# Altium schematic sheet Power VADJ.SchDoc
size Tabloid; ApprovedBy: NA
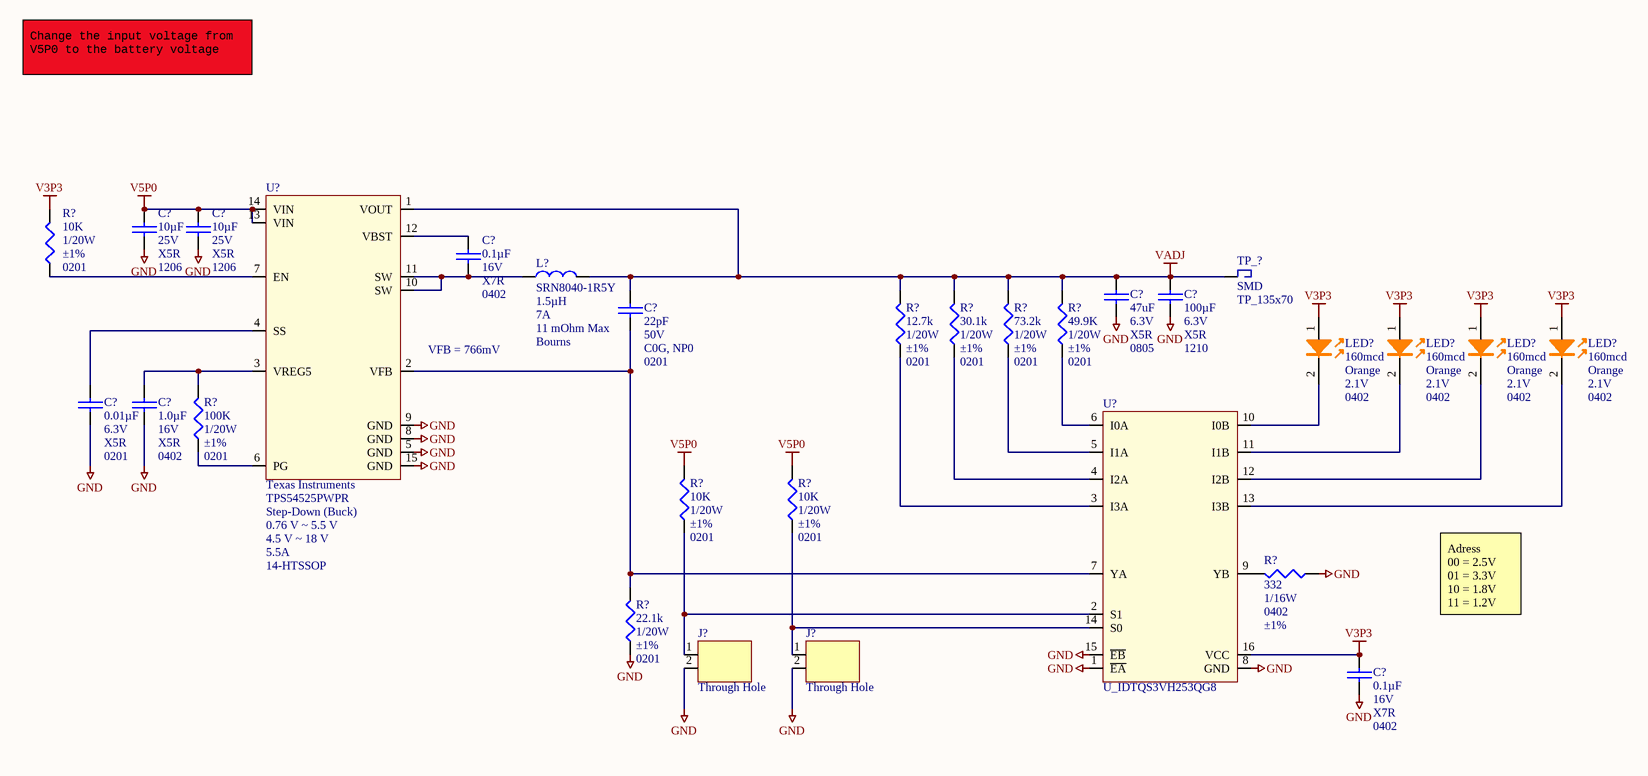
[diagram p0: Power VADJ.SchDoc]

## Parts
(Parts that share a designator on the sheet are numbered #1, #2 ... from top to bottom, then left to right.)
C?#1  Voltage - Rated: 25V  Temperature Coefficient: X5R  Package / Case: 1206  [CAP-1206]  (hidden comment: 10µF)
C?#2  Voltage - Rated: 25V  Temperature Coefficient: X5R  Package / Case: 1206  [CAP-1206]  (hidden comment: 10µF)
C?#3  Capacitance: 0.1µF  Voltage - Rated: 16V  Temperature Coefficient: X7R  Package / Case: 0402  [C_ERA-0402]  (hidden comment: 0.1uF)
C?#4  Capacitance: 22pF  Voltage - Rated: 50V  Temperature Coefficient: C0G, NP0  Package / Case: 0201  [CAPC0201]  (hidden comment: C_0201_22pF)
C?#5  Capacitance: 47uF  Voltage - Rated: 6.3V  Temperature Coefficient: X5R  Package / Case: 0805  [C_ERA-0805]  (hidden comment: C_0805_47UF_6.3V)
C?#6  Capacitance: 100µF  Voltage - Rated: 6.3V  Temperature Coefficient: X5R  Package / Case: 1210  [C_14-1210]  (hidden comment: 100uF)
C?#7  Capacitance: 0.01µF  Voltage - Rated: 6.3V  Temperature Coefficient: X5R  Package / Case: 0201  [CAPC0201]  (hidden comment: 0.01UF)
C?#8  Capacitance: 1.0µF  Voltage - Rated: 16V  Temperature Coefficient: X5R  Package / Case: 0402  [C_ERA-0402]  (hidden comment: 1.0uF)
C?#9  Capacitance: 0.1µF  Voltage - Rated: 16V  Temperature Coefficient: X7R  Package / Case: 0402  [C_ERA-0402]  (hidden comment: 0.1uF)
J?#1  Mounting Type: Through Hole  [HDR_1X2]  (hidden comment: J_HDR1X2_JUMPER)
J?#2  Mounting Type: Through Hole  [HDR_1X2]  (hidden comment: J_HDR1X2_JUMPER)
L?  Manufacturer Part Number: SRN8040-1R5Y  Inductance: 1.5µH  Current: 7A  DC Resistance (DCR): 11 mOhm Max  Manufacturer: Bourns  [INDP8080X40L]  (hidden comment: 1.5uH)
LED?#1  Millicandela Rating: 160mcd  Color: Orange  Voltage - Forward (Vf) Typ: 2.1V  Package / Case: 0402  [DIOM1005X07L_ORANGE]  (hidden comment: LED_ORN_0402)
LED?#2  Millicandela Rating: 160mcd  Color: Orange  Voltage - Forward (Vf) Typ: 2.1V  Package / Case: 0402  [DIOM1005X07L_ORANGE]  (hidden comment: LED_ORN_0402)
LED?#3  Millicandela Rating: 160mcd  Color: Orange  Voltage - Forward (Vf) Typ: 2.1V  Package / Case: 0402  [DIOM1005X07L_ORANGE]  (hidden comment: LED_ORN_0402)
LED?#4  Millicandela Rating: 160mcd  Color: Orange  Voltage - Forward (Vf) Typ: 2.1V  Package / Case: 0402  [DIOM1005X07L_ORANGE]  (hidden comment: LED_ORN_0402)
R?#1  Power (Watts): 1/20W  Tolerance: ±1%  Case: 0201  [R0201]  (hidden comment: 10K)
R?#2  Power (Watts): 1/20W  Tolerance: ±1%  Case: 0201  [R0201]  (hidden comment: 12.7k)
R?#3  Power (Watts): 1/20W  Tolerance: ±1%  Case: 0201  [R0201]  (hidden comment: 30.1k)
R?#4  Power (Watts): 1/20W  Tolerance: ±1%  Case: 0201  [R0201]  (hidden comment: 73.2k)
R?#5  Power (Watts): 1/20W  Tolerance: ±1%  Case: 0201  [R0201]  (hidden comment: 49.9K)
R?#6  Power (Watts): 1/20W  Tolerance: ±1%  Case: 0201  [R0201]  (hidden comment: 100K)
R?#7  Power (Watts): 1/20W  Tolerance: ±1%  Case: 0201  [R0201]  (hidden comment: 10K)
R?#8  Power (Watts): 1/20W  Tolerance: ±1%  Case: 0201  [R0201]  (hidden comment: 10K)
R?#9  Resistance In Ohms: 332  Power (Watts): 1/16W  Case: 0402  Tolerance: ±1%  [ERA-0402]  (hidden comment: R_0402_332.0)
R?#10  Power (Watts): 1/20W  Tolerance: ±1%  Case: 0201  [R0201]  (hidden comment: 22.1k)
TP_?  SMD  FOOTPRINT: TP_135x70  [TP_SMD]
U?#1  Manufacturer: Texas Instruments  Manufacturer Part Number: TPS54525PWPR  Type: Step-Down (Buck)  Voltage - Output: 0.76 V ~ 5.5 V  Voltage - Input: 4.5 V ~ 18 V  Current - Output: 5.5A  Supplier Device Package: 14-HTSSOP  [TSOP65P640X120_HS-15N]  (hidden comment: U_TPS54525PWPR)
U?#2  U_IDTQS3VH253QG8  [TSOP65P640X110-16N]

## Nets
GND: C?#1.1 C?#2.1 C?#5.1 C?#6.1 C?#7.1 C?#8.1 C?#9.1 J?#1.2 J?#2.2 R?#9.2 R?#10.2 U?#1.5(GND) U?#1.8(GND) U?#1.9(GND) U?#1.15(GND) U?#2.1(~{EA}) U?#2.8(GND) U?#2.15(~{EB})
V3P3: C?#9.2 LED?#1.1 LED?#2.1 LED?#3.1 LED?#4.1 R?#1.1 U?#2.16(VCC)
V5P0: C?#1.2 C?#2.2 R?#7.1 R?#8.1 U?#1.13(VIN) U?#1.14(VIN)
VADJ: C?#4.2 C?#5.2 C?#6.2 L?.2 R?#2.1 R?#3.1 R?#4.1 R?#5.1 TP_?.1 U?#1.1(VOUT)
NetC?#3_1: C?#3.1 L?.1 U?#1.10(SW) U?#1.11(SW)
NetC?#3_2: C?#3.2 U?#1.12(VBST)
NetC?#4_1: C?#4.1 R?#10.1 U?#1.2(VFB) U?#2.7(YA)
NetC?#7_2: C?#7.2 U?#1.4(SS)
NetC?#8_2: C?#8.2 R?#6.1 U?#1.3(VREG5)
NetJ?#1_1: J?#1.1 R?#7.2 U?#2.2(S1)
NetJ?#2_1: J?#2.1 R?#8.2 U?#2.14(S0)
NetLED?#1_2: LED?#1.2 U?#2.10(I0B)
NetLED?#2_2: LED?#2.2 U?#2.11(I1B)
NetLED?#3_2: LED?#3.2 U?#2.12(I2B)
NetLED?#4_2: LED?#4.2 U?#2.13(I3B)
NetR?#1_2: R?#1.2 U?#1.7(EN)
NetR?#2_2: R?#2.2 U?#2.3(I3A)
NetR?#3_2: R?#3.2 U?#2.4(I2A)
NetR?#4_2: R?#4.2 U?#2.5(I1A)
NetR?#5_2: R?#5.2 U?#2.6(I0A)
NetR?#6_2: R?#6.2 U?#1.6(PG)
NetR?#9_1: R?#9.1 U?#2.9(YB)

## Notes on the sheet
- Change the input voltage from V5P0 to the battery voltage
- (near U?#1) VFB = 766mV
- Adress
  00 = 2.5V
  01 = 3.3V
  10 = 1.8V
  11 = 1.2V
- Project:
- http://www.cospandesign.com
- Cospan Design
- Document:
- Engineer:
- Title:
- Client:
- Approved By:
- Revision:
- Date:
- Number:
- of

## Library data of the parts
C?#1 C?#2 = C_1206_10UF_25V: CAP CER 10UF 25V X5R 1206; Manufacturer: Murata Electronics North America; Manufacturer Part Number: GRM31CR61E106MA12L; Tolerance: ±20%; Supplier 1: Digi-Key; Supplier Part Number 1: 490-5423-1-ND; RoHS: RoHS Compliant; Category: Capacitors; Stock 1: 359069; Pricing: 1=0.51, 10=0.402, 50=0.2646, 100=0.2099, 250=0.15512, 500=0.12046, 1000=0.0949 (USD); Mounting Type: Surface Mount, MLCC; Operating Temperature: -55°C ~ 85°C; Applications: General Purpose; Ratings: -; Size / Dimension: 0.126" L x 0.063" W (3.20mm x 1.60mm); Height: -; Thickness: 0.071" (1.80mm); Lead Spacing: -; Features: -; Packaging: Cut Tape (CT); Lead Style: -; ComponentLink1URL: http://search.murata.co.jp/Ceramy/image/img/PDF/ENG/GRM31CR61E106MA12.pdf; ComponentLink1Description: http://search.murata.co.jp/Ceramy/image/img/PDF/ENG/GRM31CR61E106MA12.pdf; Capacitance: 10µF; COST_1: *; COST_100: *; COST_1000: *; MANF1: *; MANF1_PN: *; MANF2: *; MANF2_PN: *; MANF3: *; MANF3_PN: *; VENDOR1: *; VENDOR1_PN: *
C?#3 C?#9 = C_0402_0.1UF_16V: CAP CER .10UF 16V X7R 0402; Manufacturer: TDK Corporation; Manufacturer Part Number: C1005X7R1C104K; Tolerance: ±10%; Supplier 1: Digi-Key; Supplier Part Number 1: 445-4952-1-ND; RoHS: RoHS Compliant; Category: Capacitors; Stock 1: 230800; Pricing: 10=0.024, 100=0.0143, 500=0.00826, 1000=0.00572 (USD); Mounting Type: Surface Mount, MLCC; Features: General Purpose; Lead Spacing: -; Thickness: 0.50mm; Packaging: Cut Tape (CT); ComponentLink1URL: http://www.tdk.co.jp/tefe02/e412_c.pdf; ComponentLink1Description: http://www.tdk.co.jp/tefe02/e412_c.pdf; Operating Temperature: -55°C ~ 125°C; COST_1: *; COST_100: *; COST_1000: *; MANF1: *; MANF1_PN: *; MANF2: *; MANF2_PN: *; MANF3: *; MANF3_PN: *; VENDOR1: *; VENDOR1_PN: *
C?#4 = C_0201_22pF: CAP CER 22PF 50V 5% NP0 0201; Manufacturer: TDK Corporation; Manufacturer Part Number: C0603C0G1H220J030BA; Supplier 1: Digi-Key; Supplier Part Number 1: 445-1778-1-ND; RoHS: RoHS Compliant; Category: Capacitors; Stock 1: 37769; Pricing: 1=0.1, 10=0.024, 100=0.011, 250=0.009, 500=0.0077, 1000=0.006, 5000=0.005 (USD); Packaging: Cut Tape (CT); Tolerance: ±5%; Mounting Type: Surface Mount, MLCC; Operating Temperature: -55°C ~ 125°C; Applications: General Purpose; Ratings: -; Size / Dimension: 0.024" L x 0.012" W (0.60mm x 0.30mm); Height - Seated (Max): -; Thickness (Max): 0.013" (0.33mm); Lead Spacing: -; Features: -; Lead Style: -; ComponentLink1URL: http://product.tdk.com/capacitor/mlcc/en/documents/mlcc_commercial_general_en.pdf; ComponentLink1Description: http://product.tdk.com/capacitor/mlcc/en/documents/mlcc_commercial_general_en.pdf
C?#5 = C_0805_47UF_6.3V: Manufacturer: Taiyo Yuden; Manufacturer Part Number: JMK212BJ476MG-T; Tolerance: ±20%; Supplier 1: Digi-Key; Supplier Part Number 1: 587-1779-1-ND; RoHS: RoHS Compliant; Category: Capacitors; Stock 1: 228351; Pricing: 1=0.77, 10=0.737, 50=0.44, 100=0.3575, 250=0.297, 500=0.2695, 1000=0.2475 (USD); Mounting Type: Surface Mount, MLCC; Operating Temperature: -55°C ~ 85°C; Applications: General Purpose; Size / Dimension: 0.079" L x 0.049" W (2.00mm x 1.25mm); Thickness (Max): 0.053" (1.35mm); Packaging: Cut Tape (CT); ComponentLink1URL: http://www.yuden.co.jp/productdata/catalog/en/mlcc01_e.pdf; ComponentLink1Description: http://www.yuden.co.jp/productdata/catalog/en/mlcc01_e.pdf
C?#6 = C_1210_100UF_6.3V: CAP CER 100UF 6.3V X5R 1210; Manufacturer: Murata Electronics North America; Manufacturer Part Number: GRM32ER60J107ME20L; Tolerance: ±20%; Supplier 1: Digi-Key; Supplier Part Number 1: 490-3390-1-ND; RoHS: RoHS Compliant; Category: Capacitors; Stock 1: 1198; Pricing: 1=1.45, 10=1.189, 25=1.0732, 100=0.9573, 250=0.84128, 500=0.78328 (USD); Mounting Type: Surface Mount, MLCC; Operating Temperature: -55°C ~ 85°C; Features: -; Applications: General Purpose; Ratings: -; Size / Dimension: 0.126" L x 0.098" W (3.20mm x 2.50mm); Thickness: 2.50mm; Lead Spacing: -; Packaging: Cut Tape (CT); Lead Style: -; ComponentLink1URL: http://search.murata.co.jp/Ceramy/image/img/PDF/ENG/GRM32ER60J107ME20.pdf; ComponentLink1Description: http://search.murata.co.jp/Ceramy/image/img/PDF/ENG/GRM32ER60J107ME20.pdf; COST_1: *; COST_100: *; COST_1000: *; MANF1: *; MANF1_PN: *; MANF2: *; MANF2_PN: *; MANF3: *; MANF3_PN: *; VENDOR1: *; VENDOR1_PN: *
C?#7 = C_0201_0.01UF: CAP CER 10000PF 6.3V X5R 0201; Manufacturer: TDK Corporation; Manufacturer Part Number: C0603X5R0J103M; Tolerance: ±20%; Supplier 1: Digi-Key; Supplier Part Number 1: 445-4704-1-ND; RoHS: RoHS Compliant; Category: Capacitors; Stock 1: 31876; Pricing: 1=0.08, 10=0.05, 100=0.018, 250=0.013, 500=0.0096, 1000=0.0065 (USD); Mounting Type: Surface Mount, MLCC; Operating Temperature: -55°C ~ 85°C; Applications: General Purpose; Ratings: -; Size / Dimension: 0.024" L x 0.012" W (0.60mm x 0.30mm); Height - Seated (Max): -; Thickness (Max): 0.013" (0.33mm); Lead Spacing: -; Features: -; Packaging: Cut Tape (CT); Lead Style: -; ComponentLink1URL: http://www.tdk.com/pdf/general_B11.pdf; ComponentLink1Description: http://www.tdk.com/pdf/general_B11.pdf; COST_1: *; COST_100: *; COST_1000: *; MANF1: *; MANF1_PN: *; MANF2: *; MANF2_PN: *; MANF3: *; MANF3_PN: *; VENDOR1: *; VENDOR1_PN: *
C?#8 = C_0402_1.0UF_16V: CAP CER 1.0UF 16V X5R 0402; Manufacturer: TDK Corporation; Manufacturer Part Number: C1005X5R1C105K; Tolerance: ±10%; Packaging: Cut Tape (CT); Supplier 1: Digi-Key; Supplier Part Number 1: 445-4978-1-ND; RoHS: RoHS Compliant; Category: Capacitors; Stock 1: 414568; Pricing: 10=0.088, 100=0.052, 500=0.03, 1000=0.0208 (USD); Mounting Type: Surface Mount, MLCC; Operating Temperature: -55°C ~ 85°C; Features: Low ESR; Applications: General Purpose; Ratings: -; Size / Dimension: 0.039" L x 0.020" W (1.00mm x 0.50mm); Lead Spacing: -; Thickness: 0.50mm; Lead Style: -; ComponentLink1URL: http://www.tdk.co.jp/tefe02/e412_c.pdf; ComponentLink1Description: http://www.tdk.co.jp/tefe02/e412_c.pdf; COST_1: *; COST_100: *; COST_1000: *; MANF1: *; MANF1_PN: *; MANF2: *; MANF2_PN: *; MANF3: *; MANF3_PN: *; VENDOR1: *; VENDOR1_PN: *
J?#1 J?#2 = J_HDR1X2_JUMPER: CONN HEADER .100" 2POS TIN PCB; Manufacturer: Samtec; Manufacturer Part Number: TSW-102-07-T-S; Number of Positions: 2; Connector Type: Unshrouded; Number of Positions Loaded: All; Pitch: 0.100" (2.54mm); NOTE: This is a 1X12 header; Category: Connectors, Interconnects; Number of Rows: 1; Supplier 1: Samtec; Supplier Part Number 1: TSW-102-07-T-S; RoHS: RoHS Compliant; Row Spacing: -; Height Stacking (Mating): -; Molding Height Above Board: 0.100" (2.54mm); Contact Mating Length: 0.166" (4.22mm); Termination: Solder; Contact Finish: Tin; Contact Finish Thickness: 200µin (5.08µm); Features: -; Color: Black; ComponentLink1URL: http://www.samtec.com/ftppub/pdf/TD.PDF; ComponentLink1Description: http://www.samtec.com/ftppub/pdf/TD.PDF; COST_1: *; COST_100: *; COST_1000: *; MANF1: *; MANF1_PN: *; MANF2: *; MANF2_PN: *; MANF3: *; MANF3_PN: *; VENDOR1: *; VENDOR1_PN: *
L? = L_1.5UH_7A: INDUCTOR POWER SHIELD 1.5UH SMD; Current - Saturation: 8.2A; Type: Ferrite Core; Tolerance: ±30%; Shielding: Shielded; Material - Core: Ferrite; Frequency - Test: 100kHz; Supplier 1: Digi-Key; Supplier Part Number 1: SRN8040-1R5YCT-ND; RoHS: RoHS Compliant; Category: Inductors, Coils, Chokes; Stock 1: 2337; Pricing: 1=0.52, 10=0.44, 50=0.36, 100=0.28, 500=0.256 (USD); Current - Temperature Rise: -; Q @ Freq: -; Frequency - Self Resonant: -; Applications: Power Supplies; Package / Case: 0.315" L x 0.315" W x 0.157" H (8.00mm x 8.00mm x 4.00mm); Mounting Type: Surface Mount; Packaging: Cut Tape (CT); Operating Temperature: -40°C ~ 105°C; ComponentLink1URL: http://www.bourns.com/data/global/pdfs/SRN8040.pdf; ComponentLink1Description: http://www.bourns.com/data/global/pdfs/SRN8040.pdf; COST_1: *; COST_100: *; COST_1000: *; MANF1: *; MANF1_PN: *; MANF2: *; MANF2_PN: *; MANF3: *; MANF3_PN: *; VENDOR1: *; VENDOR1_PN: *
LED?#1-LED?#4 = LED_ORN_0402: LED 1X0.5MM 601NM ORN WTRCLR SMD; Manufacturer: Kingbright Corp; Manufacturer Part Number: APHHS1005SECK; Luminous Flux @ Current - Test: 503 mlm; Current - Test: 20mA; Wavelength - Peak: 610nm; Lens Type: Clear; Lens Style/Size: Rectangle, 0.8mm x 0.5mm; Viewing Angle: 120°; Supplier 1: Digi-Key; RoHS: RoHS Compliant; Category: Optoelectronics; Stock 1: 12357; Pricing 1: 1=0.3, 10=0.221, 25=0.1772, 100=0.1623, 250=0.14752, 500=0.13276, 1000=0.118 (USD); Wavelength - Dominant: 601nm; Mounting Type: Surface Mount; Packaging: Cut Tape (CT); ComponentLink1URL: http://www.us.kingbright.com/images/catalog/SPEC/APHHS1005SECK.pdf; ComponentLink1Description: http://www.us.kingbright.com/images/catalog/SPEC/APHHS1005SECK.pdf; Supplier Part Number 1: 754-1103-1-ND; COST_1: *; COST_100: *; COST_1000: *; MANF1: *; MANF1_PN: *; MANF2: *; MANF2_PN: *; MANF3: *; MANF3_PN: *; VENDOR1: *; VENDOR1_PN: *
R?#1 R?#7 R?#8 = R_0201_10K: RES 10K OHM 1/20W 1% 0201 SMD; Manufacturer: Rohm Semiconductor; Manufacturer Part Number: MCR006YRTF1002; Temperature Coefficient: ±250ppm/°C; Supplier 1: Digi-Key; Supplier Part Number 1: RHM10KCBTR-ND; RoHS: RoHS Compliant; Category: Resistors; Stock 1: 15000; Pricing: 15000=0.00528, 30000=0.00464, 75000=0.00426, 105000=0.00417 (USD); Packaging: Tape & Reel (TR); Resistance (Ohms): 10k; Composition: Thick Film; Features: -; Package / Case: 0201 (0603 Metric); Supplier Device Package: 0201 (0603 Metric); Size / Dimension: 0.024" L x 0.012" W (0.60mm x 0.30mm); Height: 0.010" (0.26mm); Number of Terminations: 2; ComponentLink1URL: http://rohmfs.rohm.com/en/products/databook/datasheet/passive/resistor/chip_resistor/mcr_g.pdf; ComponentLink1Description: http://rohmfs.rohm.com/en/products/databook/datasheet/passive/resistor/chip_resistor/mcr_g.pdf; Resistance In Ohms: 10K
R?#2 = R_0201_12.7K: RES 12.7K OHM 1/20W 1% 0201 SMD; Manufacturer: Panasonic Electronic Components; Manufacturer Part Number: ERJ-1GEF1272C; Temperature Coefficient: ±200ppm/°C; Supplier 1: Digi-Key; RoHS: RoHS Compliant; Category: Resistors; Stock 1: 65546; Pricing 1: 1=0.11, 50=0.0414, 100=0.0315, 250=0.0234, 500=0.01728, 1000=0.01152, 5000=0.0081 (USD); Packaging: Cut Tape (CT); Resistance (Ohms): 12.7k; Composition: Thick Film; Features: -; Package / Case: 0201 (0603 Metric); Supplier Device Package: 0201; Size / Dimension: 0.024" L x 0.012" W (0.60mm x 0.30mm); Height: 0.010" (0.26mm); Number of Terminations: 2; ComponentLink1URL: http://media.digikey.com/pdf/Data%20Sheets/Panasonic%20Resistors%20Thermistors%20PDFs/ERJ_G,R,E_Rev08.pdf; ComponentLink1Description: http://media.digikey.com/pdf/Data%20Sheets/Panasonic%20Resistors%20Thermistors%20PDFs/ERJ_G,R,E_Rev08.pdf; Resistance In Ohms: 12.7k; Supplier Part Number 1: P12.7KABCT-ND
R?#3 = R_0201_30.1k: RES 30.1K OHM 1/20W 1% 0201 SMD; Manufacturer: Panasonic Electronic Components; Manufacturer Part Number: ERJ-1GEF3012C; Temperature Coefficient: ±200ppm/°C; Supplier 1: Digi-Key; RoHS: RoHS Compliant; Category: Resistors; Stock 1: 49494; Pricing 1: 1=0.11, 50=0.0414, 100=0.0315, 250=0.0234, 500=0.01728, 1000=0.01152, 5000=0.0081 (USD); Packaging: Cut Tape (CT); Resistance (Ohms): 30.1k; Composition: Thick Film; Features: -; Package / Case: 0201 (0603 Metric); Supplier Device Package: 0201; Size / Dimension: 0.024" L x 0.012" W (0.60mm x 0.30mm); Height: 0.010" (0.26mm); Number of Terminations: 2; ComponentLink1URL: http://media.digikey.com/pdf/Data%20Sheets/Panasonic%20Resistors%20Thermistors%20PDFs/ERJ_G,R,E_Rev08.pdf; ComponentLink1Description: http://media.digikey.com/pdf/Data%20Sheets/Panasonic%20Resistors%20Thermistors%20PDFs/ERJ_G,R,E_Rev08.pdf; Resistance In Ohms: 30.1k; Supplier Part Number 1: P30.1KABCT-ND
R?#4 = R_0201_73.2k: RES 73.2K OHM 1/20W 1% 0201 SMD; Manufacturer: Panasonic Electronic Components; Manufacturer Part Number: ERJ-1GEF7322C; Temperature Coefficient: ±200ppm/°C; Supplier 1: Digi-Key; RoHS: RoHS Compliant; Category: Resistors; Stock 1: 54971; Pricing 1: 1=0.11, 50=0.0414, 100=0.0315, 250=0.0234, 500=0.01728, 1000=0.01152, 5000=0.0081 (USD); Packaging: Cut Tape (CT); Resistance (Ohms): 73.2k; Composition: Thick Film; Features: -; Package / Case: 0201 (0603 Metric); Supplier Device Package: 0201; Size / Dimension: 0.024" L x 0.012" W (0.60mm x 0.30mm); Height: 0.010" (0.26mm); Number of Terminations: 2; ComponentLink1URL: http://media.digikey.com/pdf/Data%20Sheets/Panasonic%20Resistors%20Thermistors%20PDFs/ERJ_G,R,E_Rev08.pdf; ComponentLink1Description: http://media.digikey.com/pdf/Data%20Sheets/Panasonic%20Resistors%20Thermistors%20PDFs/ERJ_G,R,E_Rev08.pdf; Resistance In Ohms: 73.2k; Supplier Part Number 1: P73.2KABCT-ND
R?#5 = R_0201_49.9K: RES 49.9K OHM 1/20W 1% 0201; Manufacturer: Samsung Electro-Mechanics America, Inc; Manufacturer Part Number: RC0603F4992CS; Temperature Coefficient: ±100ppm/°C; Supplier 1: Digi-Key; RoHS: RoHS Compliant; Category: Resistors; Stock 1: 13710; Pricing 1: 1=0.1, 10=0.051, 25=0.0368, 50=0.0282, 100=0.0208, 250=0.01584, 500=0.01268, 1000=0.00933, 2500=0.0081 (USD); Packaging: Cut Tape (CT); Resistance (Ohms): 49.9k; Composition: Thick Film; Features: -; Package/Case: 0201 (0603 Metric); Supplier Device Package: 0201 (0603 Metric); Size / Dimension: 0.024" L x 0.012" W (0.60mm x 0.30mm); Height: 0.010" (0.26mm); Number of Terminations: 2; ComponentLink1URL: http://www.samsungsem.com/servlet/FileDownload?filename=productcatalog/pdf/Chip_Resistor.pdf; ComponentLink1Description: http://www.samsungsem.com/servlet/FileDownload?filename=productcatalog/pdf/Chip_Resistor.pdf; Supplier Part Number 1: 1276-3702-1-ND; Resistance In Ohms: 49.9K
R?#6 = R_0201_100K: RES 100K OHM 1/20W 1% 0201; Manufacturer: Samsung Electro-Mechanics America, Inc; Manufacturer Part Number: RC0603F104CS; Temperature Coefficient: ±100ppm/°C; Supplier 1: Digi-Key; Supplier Part Number 1: 1276-3714-1-ND; RoHS: RoHS Compliant; Category: Resistors; Stock 1: 23473; Pricing: 1=0.1, 10=0.051, 25=0.0368, 50=0.0282, 100=0.0208, 250=0.01584, 500=0.01268, 1000=0.00933, 2500=0.0081 (USD); Packaging: Cut Tape (CT); Resistance (Ohms): 100k; Composition: Thick Film; Features: -; Package / Case: 0201 (0603 Metric); Supplier Device Package: 0201 (0603 Metric); Size / Dimension: 0.024" L x 0.012" W (0.60mm x 0.30mm); Height: 0.010" (0.26mm); Number of Terminations: 2; ComponentLink1URL: http://www.samsungsem.com/servlet/FileDownload?filename=productcatalog/pdf/Chip_Resistor.pdf; ComponentLink1Description: http://www.samsungsem.com/servlet/FileDownload?filename=productcatalog/pdf/Chip_Resistor.pdf; Resistance In Ohms: 100K
R?#9 = R_0402_332.0: RES 332 OHM 1/16W 1% 0402 SMD; Manufacturer: Vishay/Dale; Manufacturer Part Number: CRCW0402332RFKED; Temperature Coefficient: ±100ppm/°C; Supplier 1: Digi-Key; Supplier Part Number 1: 541-332LDKR-ND; RoHS: RoHS Compliant; Category: Resistors; Stock 1: 28190; Pricing: 10=0.083, 50=0.0444, 200=0.0255, 1000=0.0174 (USD); Composition: Thick Film; Features: -; Lead Style: Surface Mount (SMD - SMT); Packaging: Digi-Reel®; ComponentLink1URL: http://www.vishay.com/doc?20035; ComponentLink1Description: http://www.vishay.com/doc?20035; COST_1: *; COST_100: *; COST_1000: *; MANF1: *; MANF1_PN: *; MANF2: *; MANF2_PN: *; MANF3: *; MANF3_PN: *; VENDOR1: *; VENDOR1_PN: *
R?#10 = R_0201_22.1k: RES 22.1K OHM 1/20W 1% 0201 SMD; Manufacturer: Panasonic Electronic Components; Manufacturer Part Number: ERJ-1GEF2212C; Temperature Coefficient: ±200ppm/°C; Supplier 1: Digi-Key; RoHS: RoHS Compliant; Category: Resistors; Stock 1: 80868; Pricing 1: 1=0.11, 50=0.0414, 100=0.0315, 250=0.0234, 500=0.01728, 1000=0.01152, 5000=0.0081 (USD); Packaging: Cut Tape (CT); Resistance (Ohms): 22.1k; Composition: Thick Film; Features: -; Package / Case: 0201 (0603 Metric); Supplier Device Package: 0201; Size / Dimension: 0.024" L x 0.012" W (0.60mm x 0.30mm); Height: 0.010" (0.26mm); Number of Terminations: 2; ComponentLink1URL: http://media.digikey.com/pdf/Data%20Sheets/Panasonic%20Resistors%20Thermistors%20PDFs/ERJ_G,R,E_Rev08.pdf; ComponentLink1Description: http://media.digikey.com/pdf/Data%20Sheets/Panasonic%20Resistors%20Thermistors%20PDFs/ERJ_G,R,E_Rev08.pdf; Resistance In Ohms: 22.1k; Supplier Part Number 1: P22.1KABCT-ND
TP_? = TP_SMD: TEST POINT PC MINIATURE SMT; Manufacturer: Keystone Electronics; Manufacturer Part Number: 5015; TEMPERATURE: -55/155C; Supplier 1: Digi-Key; Supplier Part Number 1: 5015KCT-ND; RoHS: RoHS Compliant; Category: Test and Measurement; Stock 1: 365087; Pricing: 1=0.41, 10=0.386, 50=0.2814, 100=0.2704, 250=0.24284, 500=0.23178 (USD); Packaging: Cut Tape (CT); Type: PC Test Point, Miniature; Terminal: 0.010" (0.25mm) Phosphor Bronze, Silver Plated; Mounting Type: Surface Mount; Material: Phosphor Bronze; Color: -; ComponentLink1URL: http://www.keyelco.com/product-pdf.cfm?p=1353; ComponentLink1Description: http://www.keyelco.com/product-pdf.cfm?p=1353
U?#1 = U_TPS54525PWPR: IC REG BUCK SYNC ADJ 14HTSSOP; Output Type: Adjustable; Number of Outputs: 1; PWM Type: Hybrid; Frequency - Switching: 650kHz; Synchronous Rectifier: Yes; Supplier 1: Digi-Key; Supplier Part Number 1: 296-30625-1-ND; RoHS: RoHS Compliant; Category: Integrated Circuits (ICs); Stock 1: 1939; Pricing: 1=4.67, 10=4.18, 25=3.7584, 100=2.187, 250=2.14652, 500=2.106, 750=2.06551 (USD); Operating Temperature: -40°C ~ 85°C; Mounting Type: Surface Mount; Package / Case: 14-TSSOP (0.173", 4.40mm Width) Exposed Pad; Packaging: Cut Tape (CT); ComponentLink1URL: http://www.ti.com/lit/ds/symlink/tps54525.pdf; ComponentLink1Description: http://www.ti.com/lit/ds/symlink/tps54525.pdf
U?#2 = U_IDTQS3VH253QG8: IC MUX/DEMUX SW DUAL 4:1 16-QSOP; Manufacturer: IDT, Integrated Device Technology Inc; Circuit: 2 x 4:1; Independent Circuits: 1; Voltage Supply Source: Single Supply; Voltage - Supply: 2.3 V ~ 3.6 V; Supplier 1: Digi-Key; Supplier Part Number 1: 800-1765-1-ND; Manufacturer Part Number: IDTQS3VH253QG8; RoHS: RoHS Compliant; Category: Integrated Circuits (ICs); Stock 1: 12503; Pricing: 1=1.66, 25=1.322, 100=1.1567, 250=1.0144, 500=0.89964, 1000=0.71145 (USD); Type: FET Bus Switch; Current - Output High, Low: -; Operating Temperature: -40°C ~ 85°C; Mounting Type: Surface Mount; Package / Case: 16-SSOP (0.154", 3.90mm Width); Supplier Device Package: 16-QSOP; Packaging: Cut Tape (CT); ComponentLink1URL: http://www.idt.com/document/qs3vh253-datasheet; ComponentLink1Description: http://www.idt.com/document/qs3vh253-datasheet